# EAGLE design V2_1 (EAGLE 6.5.0)
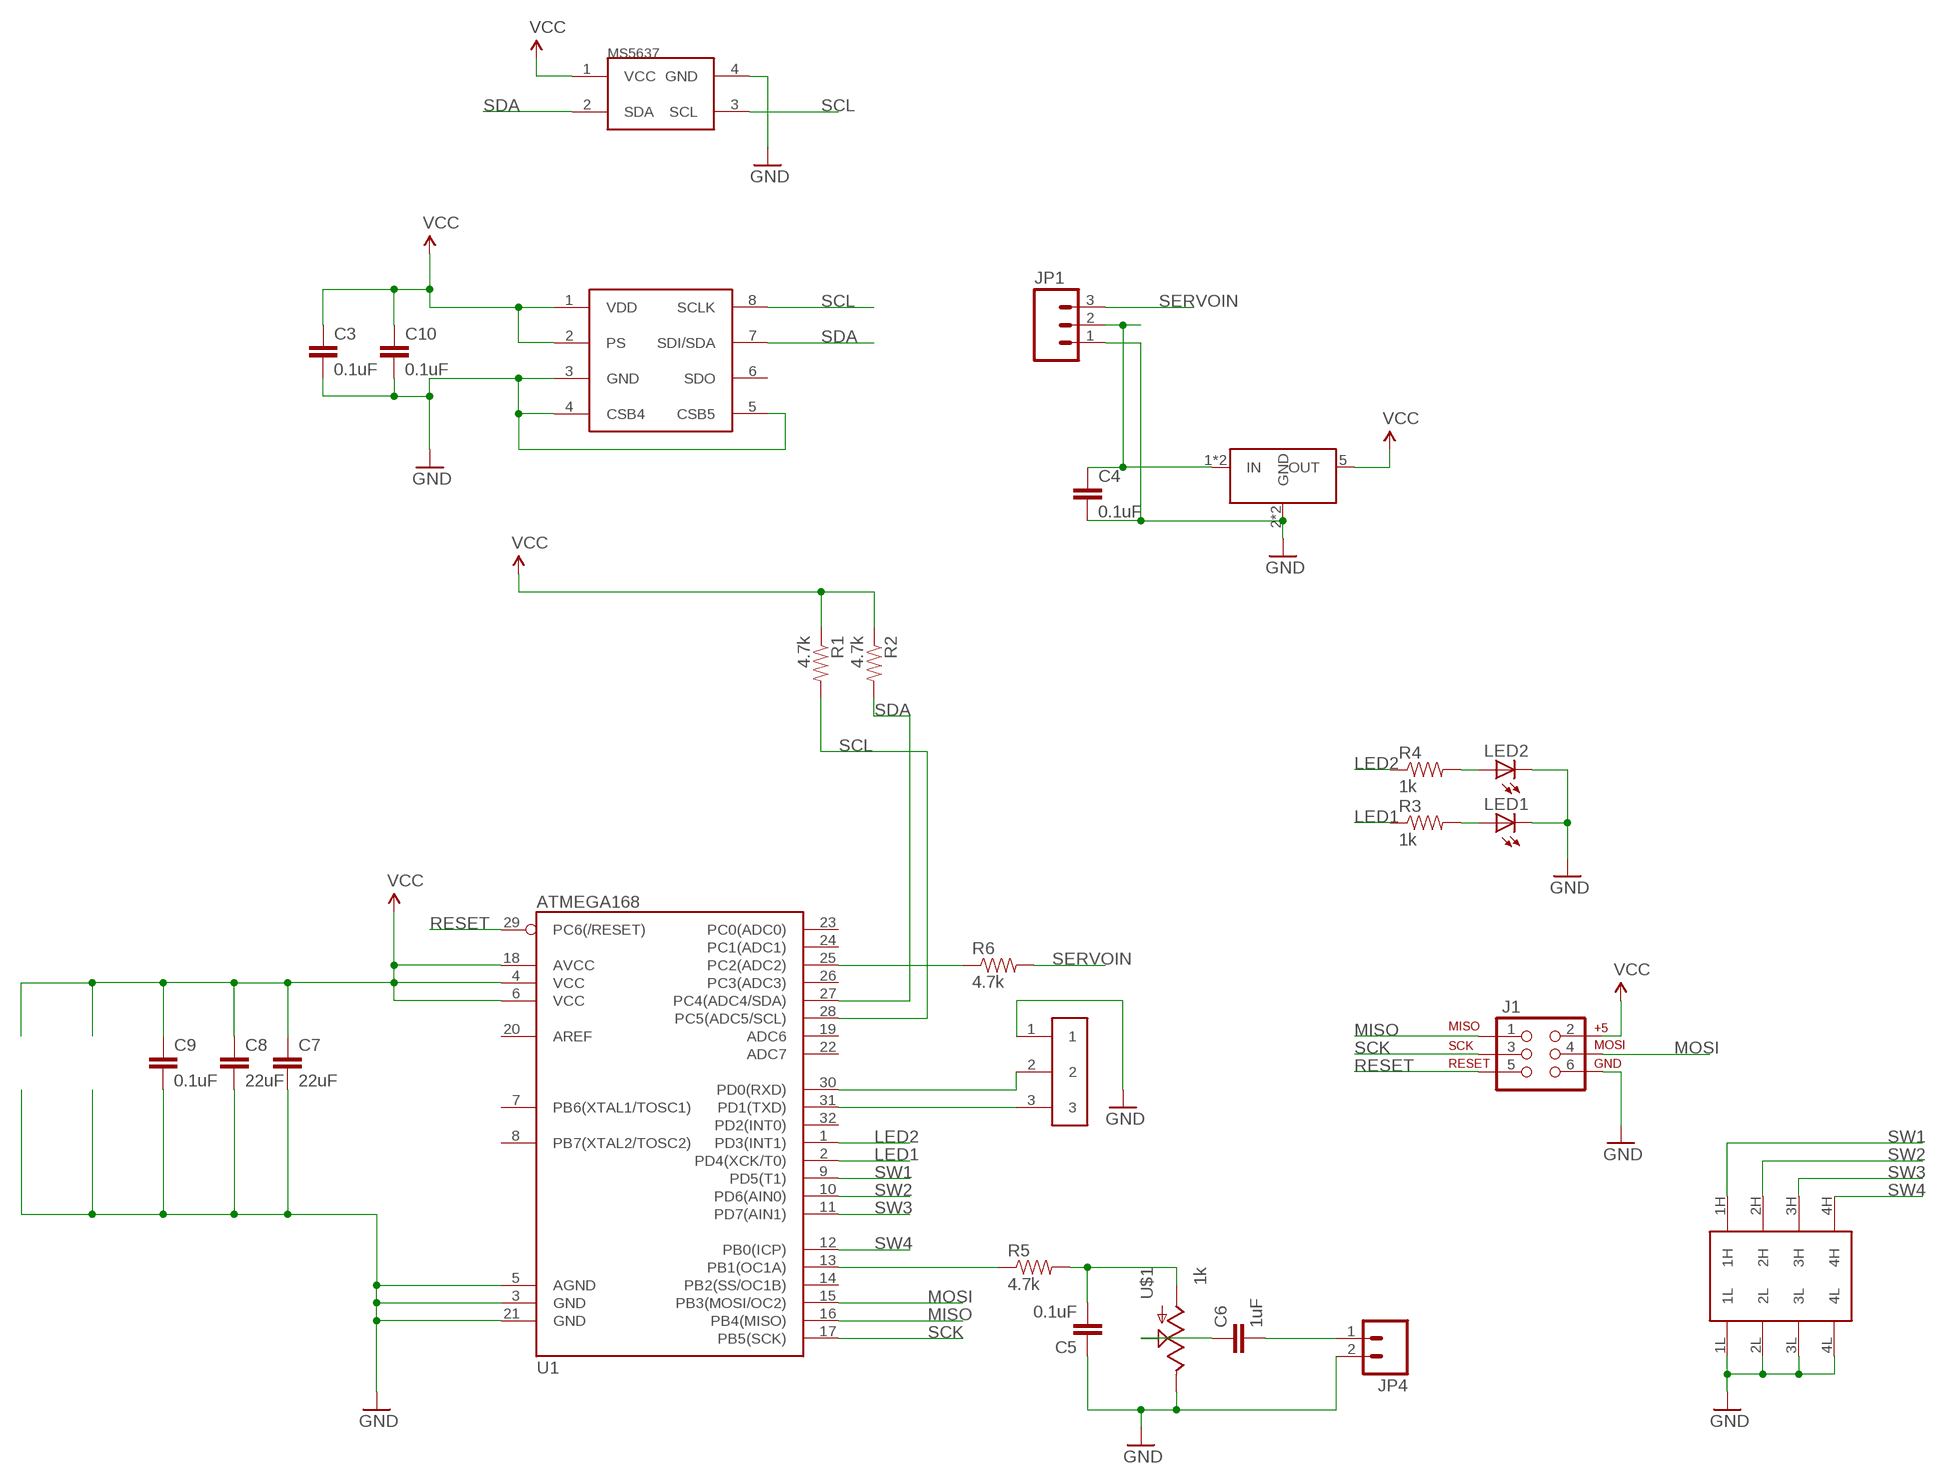
[diagram p0: schematic, sheet 1]

## Parts
C3  0.1uF  CAP0603-CAP  [0603-CAP]
C4  0.1uF  CAP0603-CAP  [0603-CAP]
C5  0.1uF  CAP0603-CAP  [0603-CAP]
C6  1uF  CAP0603-CAP  [0603-CAP]
C7  22uF  CAP0805  [0805]
C8  22uF  CAP0805  [0805]
C9  0.1uF  CAP0603-CAP  [0603-CAP]
C10  0.1uF  CAP0603-CAP  [0603-CAP]
J1  AVR_SPI_PRG_6NS  [2X3-NS]
JP1  M03PTH  [1X03]
JP4  M02PTH  [1X02]
LED1  LED0603  [LED-0603]
LED2  LED0603  [LED-0603]
R1  4.7k  RESISTOR0603-RES  [0603-RES]
R2  4.7k  RESISTOR0603-RES  [0603-RES]
R3  1k  RESISTOR0603-RES  [0603-RES]
R4  1k  RESISTOR0603-RES  [0603-RES]
R5  4.7k  RESISTOR0603-RES  [0603-RES]
R6  4.7k  RESISTOR0603-RES  [0603-RES]
U1  ATMEGA168  [TQFP32-08]
U$1  1k  POTBOURNS_3306KPW  [BOURNS_3306KPW]
U$2  MS5611  [MS5611]
U$3  LINEAR_REGSOT23-5_TOREX  [SOT23-5]
U$4  MS5637  [MS5637]
U$5  DIP_SWITCH  [DIPSWITCH4]
U$6  HEADER3  [PAD3_1X1]

## Nets
GND: C3.2 C4.2 C5.1 C7.2 C8.2 C9.2 C10.2 J1.6 JP1.1 JP4.2 LED1.C LED2.C U1.3(GND) U1.5(AGND) U1.21(GND) U$1.1(E) U$2.3(GND) U$2.4(CSB4) U$2.5(CSB5) U$3.2(GND) U$3.3(GND) U$4.4(GND) U$5.1L U$5.2L U$5.3L U$5.4L U$6.1
LED1: R3.1 U1.2(PD4(XCK/T0))
LED2: R4.1 U1.1(PD3(INT1))
MISO: J1.1 U1.16(PB4(MISO))
MOSI: J1.4 U1.15(PB3(MOSI/OC2))
N$1: R6.1 U1.25(PC2(ADC2))
N$2: C6.1 U$1.2(S)
N$3: U1.31(PD1(TXD)) U$6.3
N$4: U1.30(PD0(RXD)) U$6.2
N$6: C4.1 JP1.2 U$3.1(IN) U$3.4(IN)
N$9: LED2.A R4.2
N$10: LED1.A R3.2
N$12: R5.1 U1.13(PB1(OC1A))
N$13: C5.2 R5.2 U$1.3(A)
N$16: C6.2 JP4.1
RESET: J1.5 U1.29(PC6(/RESET))
SCK: J1.3 U1.17(PB5(SCK))
SCL: R1.2 U1.28(PC5(ADC5/SCL)) U$2.8(SCLK) U$4.3(SCL)
SDA: R2.2 U1.27(PC4(ADC4/SDA)) U$2.7(SDI/SDA) U$4.2(SDA)
SERVOIN: JP1.3 R6.2
SW1: U1.9(PD5(T1)) U$5.1H
SW2: U1.10(PD6(AIN0)) U$5.2H
SW3: U1.11(PD7(AIN1)) U$5.3H
SW4: U1.12(PB0(ICP)) U$5.4H
VCC: C3.1 C7.1 C8.1 C9.1 C10.1 J1.2 R1.1 R2.1 U1.4(VCC) U1.6(VCC) U1.18(AVCC) U$2.1(VDD) U$2.2(PS) U$3.5(OUT) U$4.1(VCC)
Unconnected: U1.7(PB6(XTAL1/TOSC1)) U1.8(PB7(XTAL2/TOSC2)) U1.14(PB2(SS/OC1B)) U1.19(ADC6) U1.20(AREF) U1.22(ADC7) U1.23(PC0(ADC0)) U1.24(PC1(ADC1)) U1.26(PC3(ADC3)) U1.32(PD2(INT0)) U$2.6(SDO)

## Library data of the parts
C3-C10 = SparkFun-Passives:CAP: Capacitor Standard 0603 ceramic capacitor, and 0.1" leaded capacitor.
J1 = SparkFun-Connectors:AVR_SPI_PRG_6: AVR ISP 6 Pin This is the reduced ISP connector for AVR programming. Common on Arduino. This footprint will take up less PCB space and can be used with a 10-pin to 6-pin adapter such as SKU: BOB-08508
JP1 = SparkFun-Connectors:M03: Header 3 Standard 3-pin 0.1" header. Use with straight break away headers (SKU : PRT-00116), right angle break away headers (PRT-00553), swiss pins (PRT-00743), machine pins (PRT-00117), and female headers (PRT-00115). Molex polarized connector foot print use with SKU : PRT-08232 with associated crimp pins and housings.
JP4 = SparkFun-Connectors:M02: Header 2 Standard 2-pin 0.1" header. Use with straight break away headers (SKU : PRT-00116), right angle break away headers (PRT-00553), swiss pins (PRT-00743), machine pins (PRT-00117), and female headers (PRT-00115). Molex polarized connector foot print use with SKU : PRT-08233 with associated crimp pins and housings.
LED1 LED2 = SparkFun-LED:LED: LEDs Standard schematic elements and footprints for 5mm, 3mm, 1206, and 0603 sized LEDs. 5mm - Spark Fun Electronics SKU : COM-00529 (and others)
R1-R6 = SparkFun-Passives:RESISTOR: Resistor Basic schematic elements and footprints for 0603, 1206, and PTH resistors.
U1 = SparkFun-DigitalIC:ATMEGA168: Atmel 32-pin 8-bit micro, 16k flash.
U$1 = Custom:POT
U$2 = Custom:MS5611
U$3 = Custom:LINEAR_REG
U$4 = Custom:MS5637
U$5 = Custom:DIP_SWITCH
U$6 = Custom:HEADER3

## Board
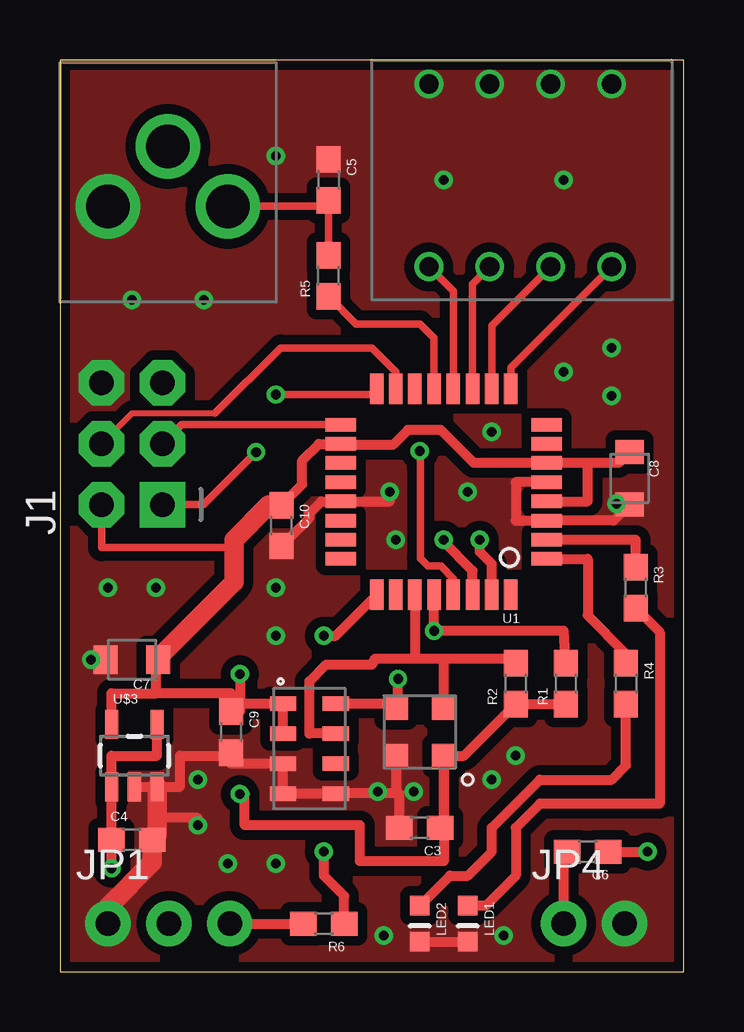
[diagram p1: board, top side]
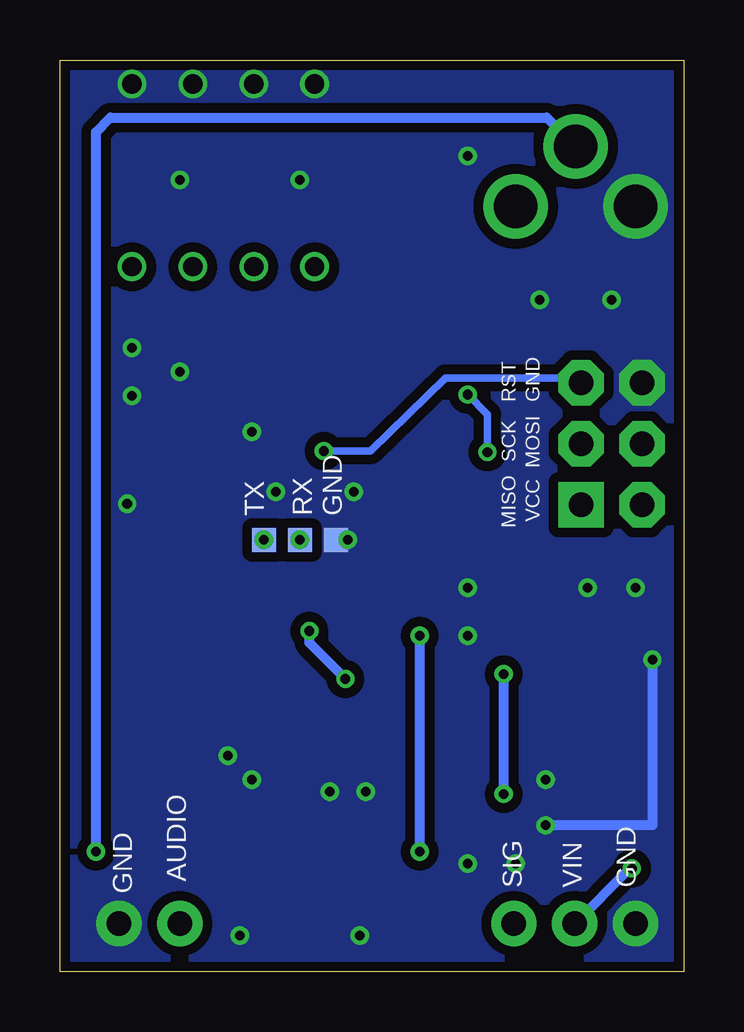
[diagram p2: board, bottom side, seen from below]

Size 26 x 38 mm. Coordinates in mm from the lower left corner, seen from the top.
Outline: 0,0 26,0 26,38 0,38 0,0
Copper layers (1*16): Top 0.0356mm / dielectric 1.5011mm / Bottom 0.0356mm
Design rules "default": minimum track width 6mil, minimum drill 13mil, track to track 6mil, track to pad 6mil, pad to pad 6mil, via to via 6mil, smd to smd 6mil, copper to edge 15mil, drill to drill 6mil, minimum pad ring 7mil, minimum via ring 7mil, stop-mask expansion 4mil, vias tented up to drill 22mil, thermal gap 10mil

### Footprints (pad centres in the part's own frame; a part is rotated, then mirrored left to right if it is on the bottom)
0603-CAP = smd 1.1 x 1: 1 -0.85,0; 2 0.85,0
0805 = smd 1 x 1.2: 1 -1.1,0; 2 1.1,0
2X3-NS = drill 1.016 pad 1.88 square: 1 -2.54,-1.27 | drill 1.016 pad 1.88 octagon: 2 -2.54,1.27; 3 0,-1.27; 4 0,1.27; 5 2.54,-1.27; 6 2.54,1.27
1X03 = drill 1.016 pad 1.88: 1 0,0; 2 2.54,0; 3 5.08,0
1X02 = drill 1.016 pad 1.88: 1 0,0; 2 2.54,0
LED-0603 = smd 0.8 x 0.8: A 0,-0.75; C 0,0.75
0603-RES = smd 1.1 x 1: 1 -0.85,0; 2 0.85,0
TQFP32-08 = smd 1.27 x 0.559: 1 -4.293,2.8; 2 -4.293,2; 3 -4.293,1.2; 4 -4.293,0.4; 5 -4.293,-0.4; 6 -4.293,-1.2; 7 -4.293,-2; 8 -4.293,-2.8; 17 4.293,-2.8; 18 4.293,-2; 19 4.293,-1.2; 20 4.293,-0.4; 21 4.293,0.4; 22 4.293,1.2; 23 4.293,2; 24 4.293,2.8 | smd 0.559 x 1.27: 9 -2.8,-4.293; 10 -2,-4.293; 11 -1.2,-4.293; 12 -0.4,-4.293; 13 0.4,-4.293; 14 1.2,-4.293; 15 2,-4.293; 16 2.8,-4.293; 25 2.8,4.293; 26 2,4.293; 27 1.2,4.293; 28 0.4,4.293; 29 -0.4,4.293; 30 -1.2,4.293; 31 -2,4.293; 32 -2.8,4.293
BOURNS_3306KPW = drill 1.8: 1 0,0; 2 2.5,2.5; 3 5,0
MS5611 = smd 1.1 x 0.6: 1 -1.1,1.875; 2 -1.1,0.625; 3 -1.1,-0.625; 4 -1.1,-1.875; 5 1.1,-1.875; 6 1.1,-0.625; 7 1.1,0.625; 8 1.1,1.875
SOT23-5 = smd 0.55 x 1.2: 1 -0.95,-1.3; 2 0,-1.3; 3 0.95,-1.3; 4 0.95,1.3; 5 -0.95,1.3
MS5637 = smd 1 x 1: 1 -1,1; 2 -1,-1; 3 1,-1; 4 1,1
DIPSWITCH4 = drill 0.8: 1H 0,7.62; 1L 0,0; 2H 2.54,7.62; 2L 2.54,0; 3H 5.08,7.62; 3L 5.08,0; 4H 7.62,7.62; 4L 7.62,0
PAD3_1X1 = smd 1 x 1: 1 -1.5,0; 2 0,0; 3 1.5,0

### Placement (x,y rotation side)
C3  15,6 180 top
C4  3,5.5 0 top
C5  11.2,33 270 top
C6  22,5 180 top
C7  3,13 180 top
C8  23.75,20.56 270 top
C9  7.13,9.98 270 top
C10  9.23,18.59 270 top
J1  3,22 90 top
JP1  2,2 0 top
JP4  21,2 0 top
LED1  17,2 180 top
LED2  15,2 180 top
R1  21.1,12 90 top
R2  19,12 90 top
R3  24,16 270 top
R4  23.6,12 270 top
R5  11.2,29 90 top
R6  11,2 180 top
U1  16,20 180 top
U$1  2,31.9 0 top
U$2  10.4,9.3 0 top
U$3  3.1,9 0 top
U$4  15,10 180 top
U$5  23,37 180 top
U$6  16,18 180 bottom

### Tracks (layer width: path | path; a pad name or v marks a point on that pad's centre or on a via)
GND  (via drill 0.4)
  Top 0.406: U$3.2 U$3.3 5,7.7 5,9 7.13,9 | 7.13,9 C9.2 | C7.2 v1.3,13 | v5.75,6.1 5.75,6.4 4.05,6.4 | 7.13,9 7.13,8.68 U$2.3 U$2.4 U$2.5 14,7.42 | C3.2 14.15,7.42 14,7.42 | U$4.4 14,7.42 | LED2.C LED1.C | C8.2 23.09,18.8 U1.3 19,18.8 19,20.4 U1.5 | C10.2 10.4,18.91 10.4,19.1 10.9,19.6 U1.21 13.75,19.6 v13.75,20
  Top 0.813: JP1.1 2,2.7 3.85,4.55 C4.2 4.05,5.7 4.05,6.4 U$3.3
  Bottom 0.406: v1.3,13 1.3,6.1 v5.75,6.1
  other vias: 18,8 19,9 18.5,1.5 13.5,1.5 5.75,8 9,4.5 7,4.5 14.75,7.5 13.25,7.5 14,18 18,22.5 17,20 23,26 23,24 21,25 2,16 4,16 9,16 9,14 3,28 6,28 16,33 21,33 9,34 23.2,19.5
  pour Bottom (isolate 0.406, no thermals): 0,38 0,0 26,0 26,38
  pour Top (isolate 0.406, no thermals): 0,38 0,0 26,0 26,38
LED1
  Top 0.406: R3.1 24,18 U1.2
LED2
  Top 0.406: U1.1 22,17.2 22,14.85 23.6,13.25 R4.1
MISO  (via drill 0.4)
  Top 0.305: J1.1 5.99,19.46 v8.18,21.65 | v9,24.05 12.96,24.05 U1.16
  Bottom 0.305: v8.18,21.65 8.18,23.23 v9,24.05
MOSI
  Top 0.254: J1.4 3,23.27 6.47,23.27
  Top 0.305: 6.47,23.27 9.2,26 13,26 14,25 U1.15
N$1  (via drill 0.4)
  Top 0.406: R6.1 11.85,3.15 11,4 v11,5 | v11,14 11.49,14 U1.25
  Bottom 0.406: v11,5 v11,14
N$2  (via drill 0.4)
  Top 0.406: C6.1 v24.5,5
  Bottom 0.406: v24.5,5 24.5,35 23.9,35.6 5.7,35.6 U$1.2
N$3  (via drill 0.4)
  Top 0.406: U1.31 18,17 17.5,17.5 U$6.3
  other vias: 17.5,18
N$4  (via drill 0.4)
  Top 0.406: U1.30 17.2,16.7 16,17.9 U$6.2
  other vias: 16,18
N$6  (via drill 0.4)
  Top 0.406: v2.15,4.3 C4.1 U$3.1 2.15,9 4.05,9 U$3.4
  Bottom 0.406: JP1.2 2.24,4.3 v2.15,4.3
N$9
  Top 0.406: LED2.A 16.25,4 17,4 18,5 18,6 20,8 23,8 23.6,8.6 R4.2
N$10
  Top 0.406: R3.2 25,14.15 25,7 20,7 19,6 19,4 17.75,2.75 LED1.A
N$12
  Top 0.305: U1.13 15.6,26.4 15,27 12.35,27 R5.1
N$13
  Top 0.305: R5.2 C5.2 10.95,31.9 U$1.3
N$16
  Top 0.406: JP4.1 21,5 C6.2
RESET  (via drill 0.4)
  Top 0.305: v15,21.7 15.03,21.02 15.03,17.23 15.35,16.9 15.88,16.9 16.4,16.38 U1.29
  Bottom 0.305: J1.5 4.48,24.75 9.93,24.75 13.05,21.7 v15,21.7
SCK
  Top 0.305: J1.3 5.07,22.8 U1.17
SCL  (via drill 0.4)
  Top 0.406: U$2.8 14,11.18 U$4.3 14.1,11.1 v14.1,12.2 | U1.28 v15.6,14.2 21,14.2 R1.2
  Bottom 0.406: v14.1,12.2 15.6,13.7 v15.6,14.2
SDA
  Top 0.406: U$2.7 10.4,9.93 10.4,12.1 11.1,12.8 13,12.8 13.15,13.05 14.8,13.05 | 14.8,13.05 16,13.05 | U$4.2 16,13.05 | U1.27 14.8,13.05 | 16,13.05 19,13.05 R2.2
SERVOIN
  Top 0.406: JP1.3 R6.2
SW1
  Top 0.305: U1.9 18.8,25.18 U$5.1H
SW2
  Top 0.305: U1.10 18,26.92 U$5.2H
SW3
  Top 0.305: U1.11 17.2,28.66 U$5.3H
SW4
  Top 0.305: U1.12 16.4,28.36 U$5.4H
VCC  (via drill 0.4)
  Top 0.305: 7.25,18 7.25,17.68 1.73,17.68 J1.2
  Top 0.406: U$3.5 2.15,11.6 4,11.6 | 4,11.6 4,13 C7.1 | C9.1 7.13,11.6 4,11.6 | C9.1 7.13,11.18 U$2.1 U$2.2 | C3.1 16,6 U$4.1 | R1.1 R2.1 16.85,9 U$4.1 | U$4.1 16,4.6 12.5,4.6 12.5,6.1 7.7,6.1 7.7,7.4 v7.5,7.4 | v7.5,12.4 7.5,10.83 C9.1 | C10.1 10.1,20.31 10.1,21.3 10.8,22 U1.18 11.76,21.95 13.88,21.95 14.5,22.57 15.88,22.57 17.25,21.2 U1.6 22,21.2 | C8.1 23.29,21.2 22,21.2 | U1.4 22,19.6 22,21.2
  Top 0.813: 4,13 7.25,16.25 7.25,18 8.69,19.44 C10.1
  Bottom 0.406: v7.5,7.4 v7.5,12.4

### Text on the board
bPlace: GND | RST | MOSI | SCK | VCC | GND | RX | TX | MISO | GND | VIN | SIG | AUDIO | GND